# EAGLE design quadcopter (EAGLE 8.7.1)
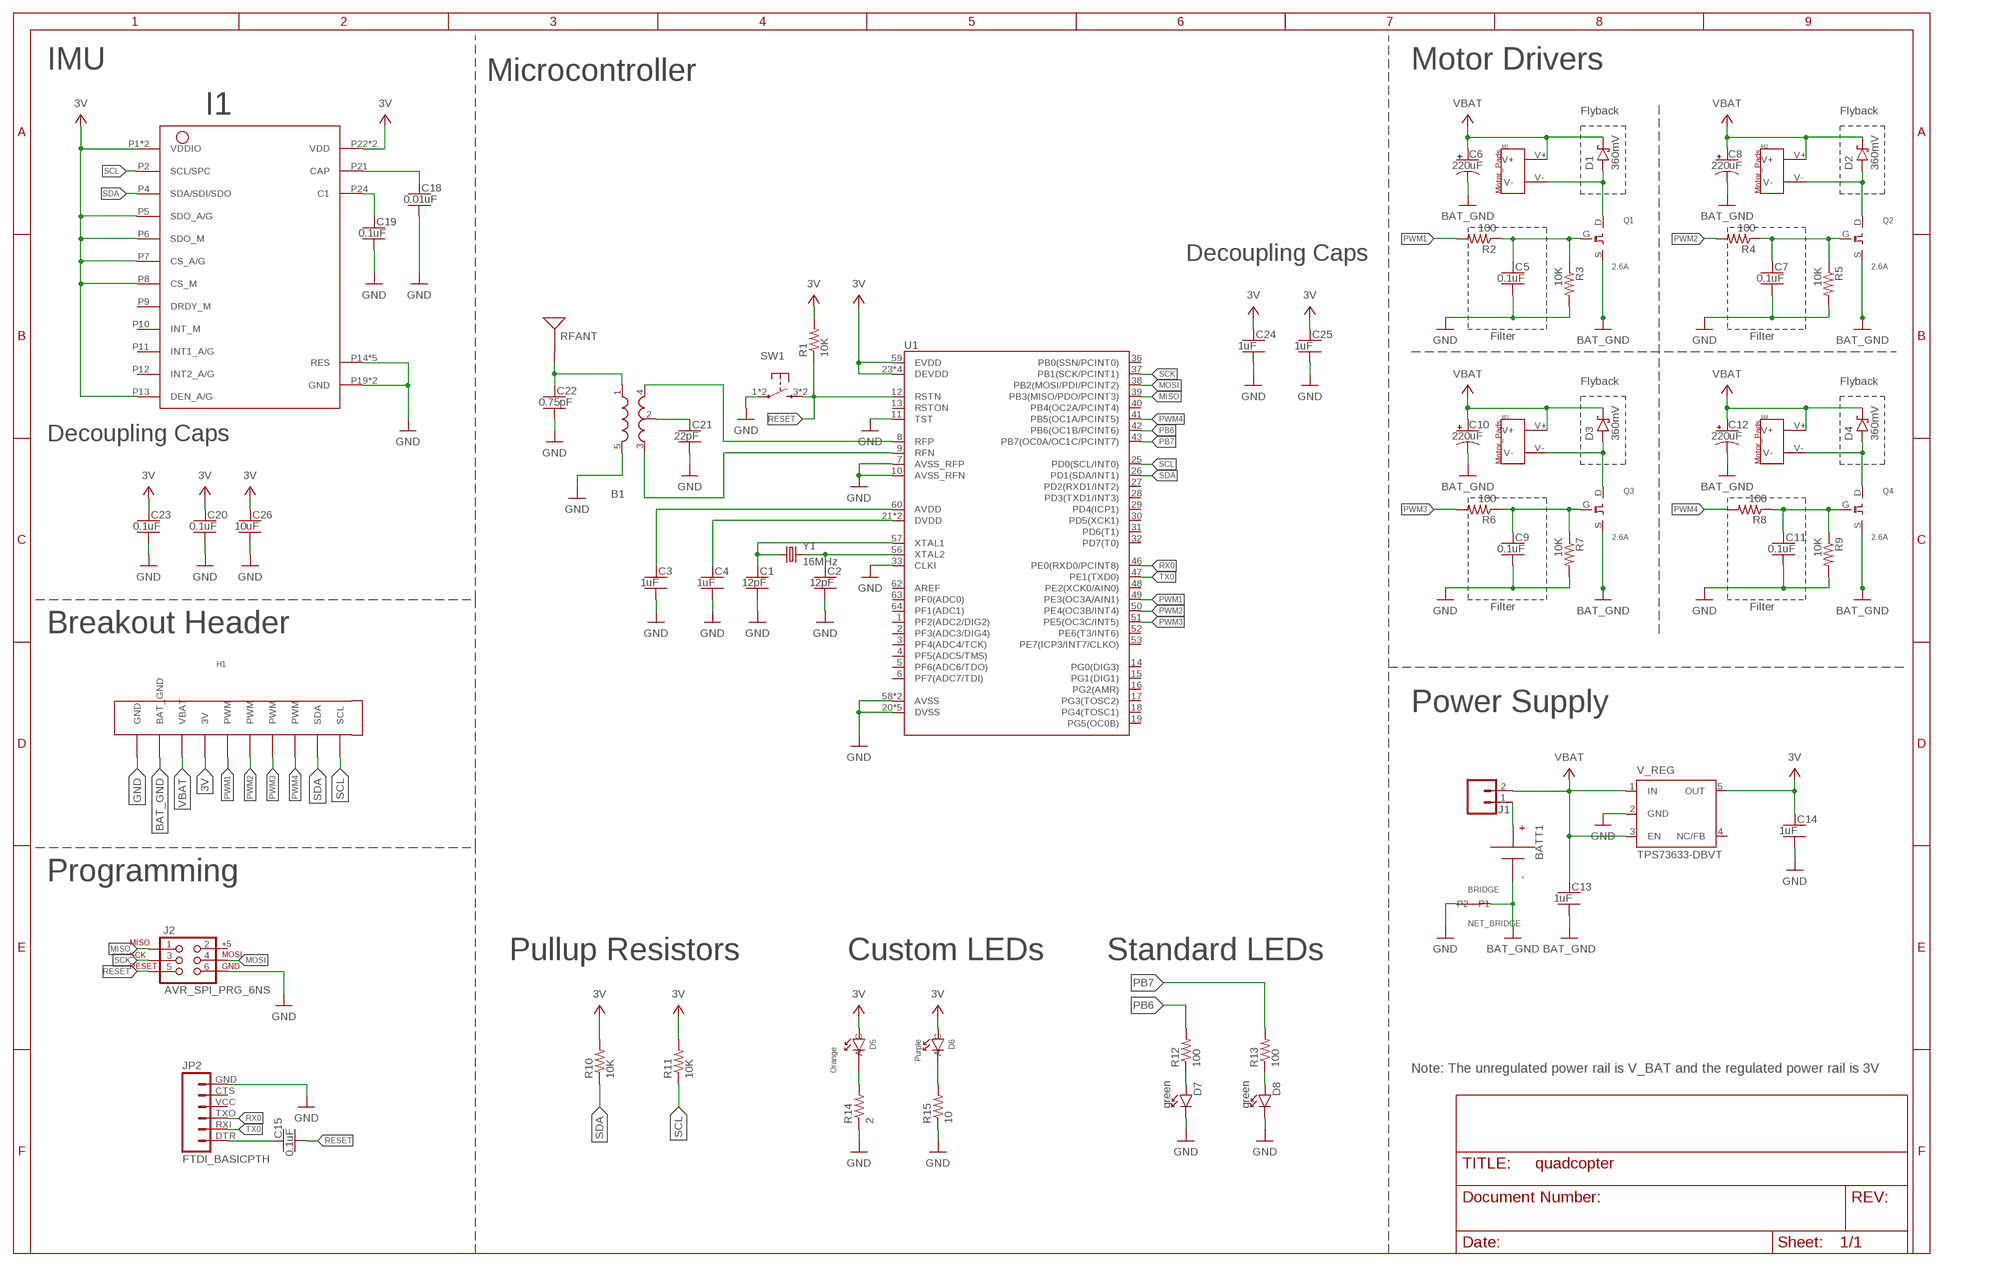
[diagram p0: schematic, sheet 1]
FRAME1 (FRAME_B_L): CREATOR: Unknown; DIST: Unknown; DISTPN: Unknown

## Parts
B1  BALUN0805  [BALUN]
BATT1  BATTERY-HUBSAN-W/HOLDER  [BATTERY-W/HOLDER-380MAH-HUBSAN]
BRIDGE  NET_BRIDGE  [NET_BRIDGE]
C1  12pF  CAPACITOR-NP_SMD-2012-0805_CERAMIC-12PF  [CAPC2012X140_HS]
C2  12pF  CAPACITOR-NP_SMD-2012-0805_CERAMIC-12PF  [CAPC2012X140_HS]
C3  1uF  CAPACITOR-NP_SMD-2012-0805_CERAMIC-1UF  [CAPC2012X140_HS]
C4  1uF  CAPACITOR-NP_SMD-2012-0805_CERAMIC-1UF  [CAPC2012X140_HS]
C5  0.1uF  CAPACITOR-NP_SMD-2012-0805_CERAMIC-0.1UF  [CAPC2012X140_HS]
C6  220uF  CAPACITOR-POL_SMD-7043-D_TANTALUM-220UF  [CAPMP7343X310_HS]
C7  0.1uF  CAPACITOR-NP_SMD-2012-0805_CERAMIC-0.1UF  [CAPC2012X140_HS]
C8  220uF  CAPACITOR-POL_SMD-7043-D_TANTALUM-220UF  [CAPMP7343X310_HS]
C9  0.1uF  CAPACITOR-NP_SMD-2012-0805_CERAMIC-0.1UF  [CAPC2012X140_HS]
C10  220uF  CAPACITOR-POL_SMD-7043-D_TANTALUM-220UF  [CAPMP7343X310_HS]
C11  0.1uF  CAPACITOR-NP_SMD-2012-0805_CERAMIC-0.1UF  [CAPC2012X140_HS]
C12  220uF  CAPACITOR-POL_SMD-7043-D_TANTALUM-220UF  [CAPMP7343X310_HS]
C13  1uF  CAPACITOR-NP_SMD-2012-0805_CERAMIC-1UF  [CAPC2012X140_HS]
C14  1uF  CAPACITOR-NP_SMD-2012-0805_CERAMIC-1UF  [CAPC2012X140_HS]
C15  0.1uF  CAPACITOR-NP_SMD-2012-0805_CERAMIC-0.1UF  [CAPC2012X140_HS]
C18  0.01uF  CAPACITOR-NP_SMD-2012-0805_CERAMIC-0.01UF  [CAPC2012X140_HS]
C19  0.1uF  CAPACITOR-NP_SMD-2012-0805_CERAMIC-0.1UF  [CAPC2012X140_HS]
C20  0.1uF  CAPACITOR-NP_SMD-2012-0805_CERAMIC-0.1UF  [CAPC2012X140_HS]
C21  22pF  CAPACITOR-NP_SMD-2012-0805_CERAMIC-22PF  [CAPC2012X140_HS]
C22  0.75pF  CAPACITOR-NP_SMD-2012-0805_CERAMIC-0.75PF  [CAPC2012X140_HS]
C23  0.1uF  CAPACITOR-NP_SMD-2012-0805_CERAMIC-0.1UF  [CAPC2012X140_HS]
C24  1uF  CAPACITOR-NP_SMD-2012-0805_CERAMIC-1UF  [CAPC2012X140_HS]
C25  1uF  CAPACITOR-NP_SMD-2012-0805_CERAMIC-1UF  [CAPC2012X140_HS]
C26  10uF  CAPACITOR-NP_SMD-2012-0805_CERAMIC-10UF  [CAPC2012X140_HS]
D1  360mV  DIODE-SCHOTTKY_SMD-SOD123-360MV  [SOD3716X135_HS]
D2  360mV  DIODE-SCHOTTKY_SMD-SOD123-360MV  [SOD3716X135_HS]
D3  360mV  DIODE-SCHOTTKY_SMD-SOD123-360MV  [SOD3716X135_HS]
D4  360mV  DIODE-SCHOTTKY_SMD-SOD123-360MV  [SOD3716X135_HS]
D5  Orange  LED_ORANGE  [LED_ORANGE]
D6  Purple  LED_PURPLE  [LED_PURPLE]
D7  green  DIODE-LED_SMD-2012-0805-GREEN  [LEDSC125X200X120-2_HS]
D8  green  DIODE-LED_SMD-2012-0805-GREEN  [LEDSC125X200X120-2_HS]
H1  BREAKOUT_HEADER  [BREAKOUT_HEADER]
I1  IMU_LSM9DS1TR  [IMU_LSM9DS1TR]
J1  MALE_HEADER_2POS-2X1-0.1IN  [MALE_HEADER_2X1_0.1IN]
J2  AVR_SPI_PRG_6NS  [2X3-NS]
JP2  FTDI_BASICPTH  [FTDI_BASIC]
M1  MOTOR_PADS  [MOTOR_PADS]
M2  MOTOR_PADS  [MOTOR_PADS]
M3  MOTOR_PADS  [MOTOR_PADS]
M4  MOTOR_PADS  [MOTOR_PADS]
Q1  2.6A  N_CHANNEL_FET  [MOSFET_N-CHANNEL]
Q2  2.6A  N_CHANNEL_FET  [MOSFET_N-CHANNEL]
Q3  2.6A  N_CHANNEL_FET  [MOSFET_N-CHANNEL]
Q4  2.6A  N_CHANNEL_FET  [MOSFET_N-CHANNEL]
R1  10K  RESISTOR_SMD-2012-0805-10K  [RESC2012X60_HS]
R2  100  RESISTOR_SMD-2012-0805-100  [RESC2012X60_HS]
R3  10K  RESISTOR_SMD-2012-0805-10K  [RESC2012X60_HS]
R4  100  RESISTOR_SMD-2012-0805-100  [RESC2012X60_HS]
R5  10K  RESISTOR_SMD-2012-0805-10K  [RESC2012X60_HS]
R6  100  RESISTOR_SMD-2012-0805-100  [RESC2012X60_HS]
R7  10K  RESISTOR_SMD-2012-0805-10K  [RESC2012X60_HS]
R8  100  RESISTOR_SMD-2012-0805-100  [RESC2012X60_HS]
R9  10K  RESISTOR_SMD-2012-0805-10K  [RESC2012X60_HS]
R10  10K  RESISTOR_SMD-2012-0805-10K  [RESC2012X60_HS]
R11  10K  RESISTOR_SMD-2012-0805-10K  [RESC2012X60_HS]
R12  100  RESISTOR_SMD-2012-0805-100  [RESC2012X60_HS]
R13  100  RESISTOR_SMD-2012-0805-100  [RESC2012X60_HS]
R14  2  0805_RES2_OHM  [RESISTOR_0805]
R15  10  0805_RES10_OHM  [RESISTOR_0805]
RFANT  ANTENNA2SMD5  [ANTENNA-CHIP5]
SW1  PUSHBUTTON_SMD-VERTICAL-1  [TE_FSM8JSMA_HS]
U1  ATMEGA128RFA1  [QFN-64]
V_REG  TPS73633-DBVT  [SOT23-DBV]
Y1  16MHz  CRYSTAL5X3  [CRYSTAL-SMD-5X3]

## Nets
3V: C14.1 C20.1 C23.1 C24.1 C25.1 C26.1 D5.A D6.A H1.1(3V) I1.P1(VDDIO) I1.P3(VDDIO) I1.P5(SDO_A/G) I1.P6(SDO_M) I1.P7(CS_A/G) I1.P8(CS_M) I1.P13(DEN_A/G) I1.P22(VDD) I1.P23(VDD) R1.2 R10.2 R11.2 U1.23(DEVDD) U1.34(DEVDD) U1.44(DEVDD) U1.54(DEVDD) U1.59(EVDD) V_REG.5(OUT)
BAT_GND [HIGHCURRENT]: BATT1.-(N) BRIDGE.P2 C6.2(-) C8.2(-) C10.2(-) C12.2(-) C13.2 H1.2(BAT_GND) Q1.S Q2.S Q3.S Q4.S
GND: B1.5(GND) BRIDGE.P1 C1.2 C2.2 C3.2 C4.2 C5.2 C7.2 C9.2 C11.2 C14.2 C18.2 C19.2 C20.2 C21.2 C22.2 C23.2 C24.2 C25.2 C26.2 D7.C D8.C H1.3(GND) I1.P14(RES) I1.P15(RES) I1.P16(RES) I1.P17(RES) I1.P18(RES) I1.P19(GND) I1.P20(GND) J2.6 JP2.GND R3.2 R5.2 R7.2 R9.2 R14.IN R15.IN SW1.1 SW1.2 U1.7(AVSS_RFP) U1.10(AVSS_RFN) U1.11(TST) U1.20(DVSS) U1.24(DVSS) U1.33(CLKI) U1.35(DVSS) U1.45(DVSS) U1.55(DVSS) U1.58(AVSS) U1.61(AVSS) V_REG.2(GND)
MISO: J2.1 U1.39(PB3(MISO/PDO/PCINT3))
MOSI: J2.4 U1.38(PB2(MOSI/PDI/PCINT2))
N$1: D6.C R15.OUT
N$2: B1.4(OUT1) U1.8(RFP)
N$3: B1.3(OUT2) U1.9(RFN)
N$4: C4.1 U1.21(DVDD) U1.22(DVDD)
N$5: C2.1 U1.56(XTAL2) Y1.3
N$6: C3.1 U1.60(AVDD)
N$7: C1.1 U1.57(XTAL1) Y1.1
N$8 [HIGHCURRENT]: D1.A M1.V- Q1.D
N$9: D5.C R14.OUT
N$10: C7.1 Q2.G R4.1 R5.1
N$11 [HIGHCURRENT]: D2.A M2.V- Q2.D
N$12: C9.1 Q3.G R6.1 R7.1
N$13: C5.1 Q1.G R2.1 R3.1
N$14 [HIGHCURRENT]: D3.A M3.V- Q3.D
N$15: C11.1 Q4.G R8.1 R9.1
N$17: D7.A R12.1
N$18 [HIGHCURRENT]: BATT1.+(P) J1.1
N$19: B1.2(GND) C21.1
N$20 [HIGHCURRENT]: D4.A M4.V- Q4.D
N$21: C18.1 I1.P21(CAP)
N$23: C19.1 I1.P24(C1)
N$24 [RFSIG]: B1.1(IN) C22.1 RFANT.FEED(SIGNAL)
N$25: C15.1 JP2.DTR
N$26: D8.A R13.1
PB6: R12.2 U1.42(PB6(OC1B/PCINT6))
PB7: R13.2 U1.43(PB7(OC0A/OC1C/PCINT7))
PWM1: H1.4(PWM) R2.2 U1.49(PE3(OC3A/AIN1))
PWM2: H1.5(PWM) R4.2 U1.50(PE4(OC3B/INT4))
PWM3: H1.6(PWM) R6.2 U1.51(PE5(OC3C/INT5))
PWM4: H1.7(PWM) R8.2 U1.41(PB5(OC1A/PCINT5))
RESET: C15.2 J2.5 R1.1 SW1.3 SW1.4 U1.12(RSTN)
RX0: JP2.TXO U1.46(PE0(RXD0/PCINT8))
SCK: J2.3 U1.37(PB1(SCK/PCINT1))
SCL: H1.8(SCL) I1.P2(SCL/SPC) R11.1 U1.25(PD0(SCL/INT0))
SDA: H1.9(SDA) I1.P4(SDA/SDI/SDO) R10.1 U1.26(PD1(SDA/INT1))
TX0: JP2.RXI U1.47(PE1(TXD0))
VBAT [HIGHCURRENT]: C6.1(+) C8.1(+) C10.1(+) C12.1(+) C13.1 D1.C D2.C D3.C D4.C H1.10(VBAT) J1.2 M1.V+ M2.V+ M3.V+ M4.V+ V_REG.1(IN) V_REG.3(EN)
Unconnected: I1.P9(DRDY_M) I1.P10(INT_M) I1.P11(INT1_A/G) I1.P12(INT2_A/G) J2.2 JP2.CTS JP2.VCC U1.1(PF2(ADC2/DIG2)) U1.2(PF3(ADC3/DIG4)) U1.3(PF4(ADC4/TCK)) U1.4(PF5(ADC5/TMS)) U1.5(PF6(ADC6/TDO)) U1.6(PF7(ADC7/TDI)) U1.13(RSTON) U1.14(PG0(DIG3)) U1.15(PG1(DIG1)) U1.16(PG2(AMR)) U1.17(PG3(TOSC2)) U1.18(PG4(TOSC1)) U1.19(PG5(OC0B)) U1.27(PD2(RXD1/INT2)) U1.28(PD3(TXD1/INT3)) U1.29(PD4(ICP1)) U1.30(PD5(XCK1)) U1.31(PD6(T1)) U1.32(PD7(T0)) U1.36(PB0(SSN/PCINT0)) U1.40(PB4(OC2A/PCINT4)) U1.48(PE2(XCK0/AIN0)) U1.52(PE6(T3/INT6)) U1.53(PE7(ICP3/INT7/CLKO)) U1.62(AREF) U1.63(PF0(ADC0)) U1.64(PF1(ADC1)) V_REG.4(NC/FB)

## Notes on the sheet
- IMU | Motor Drivers
- Microcontroller
- Flyback | Flyback
- Decoupling Caps
- Filter | Filter
- Flyback | Flyback
- Decoupling Caps
- Filter | Filter
- Breakout Header
- Power Supply
- Programming
- Pullup Resistors | Custom LEDs | Standard LEDs
- Note: The unregulated power rail is V_BAT and the regulated power rail is 3V

## Library data of the parts
B1 = quadparts_prebuilt:BALUN: 0805 footprint balun- Ember 351/357; CREATOR: Swanson; DATASHEET: http://katalog.we-online.de/pbs/datasheet/748421245.pdf; DIST: Digikey; DISTPN: 732-2230-6-ND; MFR: Wurth Electronics Inc; MPN: 748421245; PRICE: 2.63; REVIEWER: Swanson
BATT1 = quadparts_prebuilt:BATTERY; CREATOR: Swanson; DIST: AMAZON; DISTPN: http://www.amazon.com/dp/B00RROB6Q4?smid=AMNTPWSAB5H0S; MFR: HUBSAN; MPN: X4-H107C-8-in-1; REVIEWER: Swanson
BRIDGE = custom_Ben:NET_BRIDGE: NET BRIDGE; CREATOR: AGONZALES; DIST: NA; DISTPN: NA
C1 C2 = quadparts_prebuilt:CAPACITOR-NP_: Nonpolarized capacitor; CREATOR: Swanson; DIST: Digikey; DISTPN: 490-5531-1-ND; MFR: Murata Electronics North America; MPN: GRM21A5C2E120JW01D; REVIEWER: Swanson
C3 C4 C13 C14 C24 C25 = quadparts_prebuilt:CAPACITOR-NP_: Nonpolarized capacitor; CREATOR: Swanson; DIST: Digikey; DISTPN: 587-1281-1-ND; MFR: Taiyo Yuden; MPN: TMK212B7105KG-T; REVIEWER: Swanson
C5 C7 C9 C11 C15 C19 C20 C23 = quadparts_prebuilt:CAPACITOR-NP_: Nonpolarized capacitor; CREATOR: Swanson; DIST: Digikey; DISTPN: 445-1418-1-ND; MFR: TDK; MPN: C2012X7R2A104K125AA; REVIEWER: Swanson
C6 C8 C10 C12 = quadparts_prebuilt:CAPACITOR-POL_: Polarized capacitor; CREATOR: Swanson; DIST: Digikey; DISTPN: 478-8912-1-ND; MFR: AVX Corporation; MPN: TAJD227K006RNJ; REVIEWER: Swanson
C18 = quadparts_prebuilt:CAPACITOR-NP_: Nonpolarized capacitor; CREATOR: Swanson; DIST: Digikey; DISTPN: 1608-1458-1-ND; MFR: Knowles Syfer; MPN: 0805J0500104KJT; REVIEWER: Swanson
C21 = quadparts_prebuilt:CAPACITOR-NP_: Nonpolarized capacitor; CREATOR: Swanson; DIST: Digikey; DISTPN: 490-5534-1-ND; MFR: Murata Electronics North America; MPN: GRM21A5C2E220JW01D; REVIEWER: Swanson
C22 = quadparts_prebuilt:CAPACITOR-NP_: Nonpolarized capacitor; CREATOR: Swanson; DIST: Digikey; DISTPN: 490-3585-1-ND; MFR: Murata Electronics North America; MPN: GQM2195C2AR75CB01D; REVIEWER: Swanson
C26 = quadparts_prebuilt:CAPACITOR-NP_: Nonpolarized capacitor; CREATOR: Swanson; DIST: Digikey; DISTPN: 445-14388-1-ND; MFR: TDK Corporation; MPN: C2012X5R1E106M085AC; REVIEWER: Swanson
D1-D4 = quadparts_prebuilt:DIODE-SCHOTTKY_: Schottky diode; CREATOR: Swanson; DIST: Digikey; DISTPN: CRS08QMCT-ND; MFR: Toshiba Semiconductor and Storage; MPN: CRS08(TE85L,Q,M); REVIEWER: Swanson
D5 = LED:LED_ORANGE: Orange LED by Lumileds Forward Voltage: 2.1V Max Current: 125mA Mounting Type: Surface Mount; CREATOR: Ben Phan; DIST: Digikey; DISTPN: 1416-1492-6-ND; MFR: Lumileds; MPN: L135-O615003500001
D6 = LED:LED_PURPLE: Purple LED by Lumileds Forward Voltage: 2.8V Max current: 300mA Mounting Type: Surface Mount; CREATOR: Ben Phan; DIST: Digikey; DISTPN: 1416-1961-1-ND; MFR: Lumileds; MPN: L1SP-PRP2003500000
D7 D8 = quadparts_prebuilt:DIODE-LED_: Light emitting diode; CREATOR: Swanson; DIST: Digikey; DISTPN: 160-1179-1-ND; MFR: Lite-On Inc; MPN: LTST-C170GKT; REVIEWER: Swanson
H1 = custom_Ben:BREAKOUT_HEADER: Breakout Header; CREATOR: Ben Phan; DIST: NA; DISTPN: NA
I1 = custom:IMU_LSM9DS1TR; CREATOR: AGONZALES; DIST: DIGIKEY; DISTPN: 497-14946-1-ND; MFR: STMicroelectronics
J1 = custom_Ben:MALE_HEADER_2POS: 2 pin single inline pin header, socket, or connector; CREATOR: SWANSON; DIST: Digikey; DISTPN: 3M9447-ND; MFR: 3M; MPN: 961102-6404-AR; REVIEWER: Swanson
J2 = quadparts_prebuilt:AVR_SPI_PRG_6: AVR ISP 6 Pin This is the reduced ISP connector for AVR programming. Common on Arduino. This footprint will take up less PCB space and can be used with a 10-pin to 6-pin adapter such as SKU: BOB-08508; CREATOR: Swanson; DATASHEET: http://portal.fciconnect.com/Comergent//fci/drawing/67996.pdf; DIST: Digikey; DISTPN: 609-3234-ND; MFR: Amphenol FCI; MPN: 67997-206HLF; PRICE: 0.31; REVIEWER: Swanson
JP2 = quadparts_prebuilt:FTDI_BASIC: FTDI Basic header with labels; CREATOR: Swanson; DATASHEET: http://portal.fciconnect.com/Comergent//fci/drawing/68015.pdf; DIST: Digikey; DISTPN: 609-3327-ND; MFR: Amphenol FCI; MPN: 68016-406HLF; PRICE: 0.33; REVIEWER: Swanson
M1-M4 = quadparts_prebuilt:MOTOR_PADS; CREATOR: Swanson; DIST: NA; DISTPN: NA; MFR: NA; MPN: NA; REVIEWER: Swanson
Q1-Q4 = custom_Ben:N_CHANNEL_FET: N-Channel MOSFET; CREATOR: Ben Phan; DIST: Digikey; DISTPN: SI2302CDS-T1-E3CT-ND; MFR: Vishay Siliconix; MPN: SI2302CDS-T1-E3
R1 R3 R5 R7 R9-R11 = quadparts_prebuilt:RESISTOR_: Resistor; CREATOR: Swanson; DIST: Digikey; DISTPN: 311-10KARCT-ND; MFR: Yageo; MPN: RC0805JR-0710KL; REVIEWER: Swanson
R2 R4 R6 R8 R12 R13 = quadparts_prebuilt:RESISTOR_: Resistor; CREATOR: Swanson; DIST: Digikey; DISTPN: 311-100ARCT-ND; MFR: Yageo; MPN: RC0805JR-07100RL; REVIEWER: Swanson
R14 = custom_Ben:0805_RES: 0805 Resistors; CREATOR: AGONZALES; DIST: DIGIKEY; DISTPN: 311-2.0ARCT-ND
R15 = custom_Ben:0805_RES: 0805 Resistors; CREATOR: AGONZALES; DIST: DIGIKEY; DISTPN: 311-10.0CRCT-ND
RFANT = quadparts_prebuilt:ANTENNA2: Chip antenna Single endded antenna. Common with smaller chip antennas. CHIP4 package is the GPS Chip Antenna SKU: GPS-08418. CHIP5 package is 2.4GHz chip antenna SKU: WRL-00144.; CREATOR: Swanson; DATASHEET: http://www.linxtechnologies.com/resources/data-guides/ant-xxx-chp-x.pdf; DIST: Digikey; DISTPN: ANT-2.45-CHPCT-ND; MFR: Linx Technologies Inc.; MPN: ANT-2.45-CHP-T; PRICE: 3.16; REVIEWER: Swanson
SW1 = quadparts_prebuilt:PUSHBUTTON_: Pushbutton with 2 pins shorting 1 to 2 and two extra mounting pins 3 & 4; CREATOR: Swanson; DIST: Digikey; DISTPN: 450-1129-ND; MFR: TE Connectivity Alcoswitch Switches; MPN: FSM4JSMA; REVIEWER: Swanson
U1 = quadparts_prebuilt:ATMEGA128RFA1: ATmega128RFA1 8-bit AVR Microcontroller with Low Power 2.4GHz Transceiver for ZigBee and IEEE 802.15.4; CREATOR: Swanson; DATASHEET: http://www.atmel.com/Images/Atmel-8266-MCU_Wireless-ATmega128RFA1_Datasheet.pdf; DIST: Digikey; DISTPN: ATMEGA128RFA1-ZU-ND; MFR: Atmel; MPN: ATMEGA128RFA1-ZUR00; PRICE: 10.21; REVIEWER: Swanson
V_REG = quadparts_prebuilt:TPS73633-DBVT; CREATOR: Swanson; DATASHEET: http://www.ti.com/lit/ds/symlink/lp3985.pdf; DIST: Digikey; DISTPN: LP3985IM5X-3.0/NOPBCT-ND; MFR: Texas Instruments; MPN: LP3985IM5X-3.0/NOPB; PRICE: 0.59; REVIEWER: Swanson
Y1 = quadparts_prebuilt:CRYSTAL: Various standard crystals. Proven footprints.; CREATOR: Swanson; DATASHEET: http://www.abracon.com/Resonators/abm3b.pdf; DIST: Digikey; DISTPN: 535-9122-1-ND; MFR: Abracon LLC; MPN: ABM3B-16.000MHZ-B2-T; PRICE: 0.68; PROD_ID: XTAL-08218; REVIEWER: Swanson

## Net classes
1 RFSIG: width 0.762 mm
2 HIGHCURRENT: width 0.762 mm

## Board
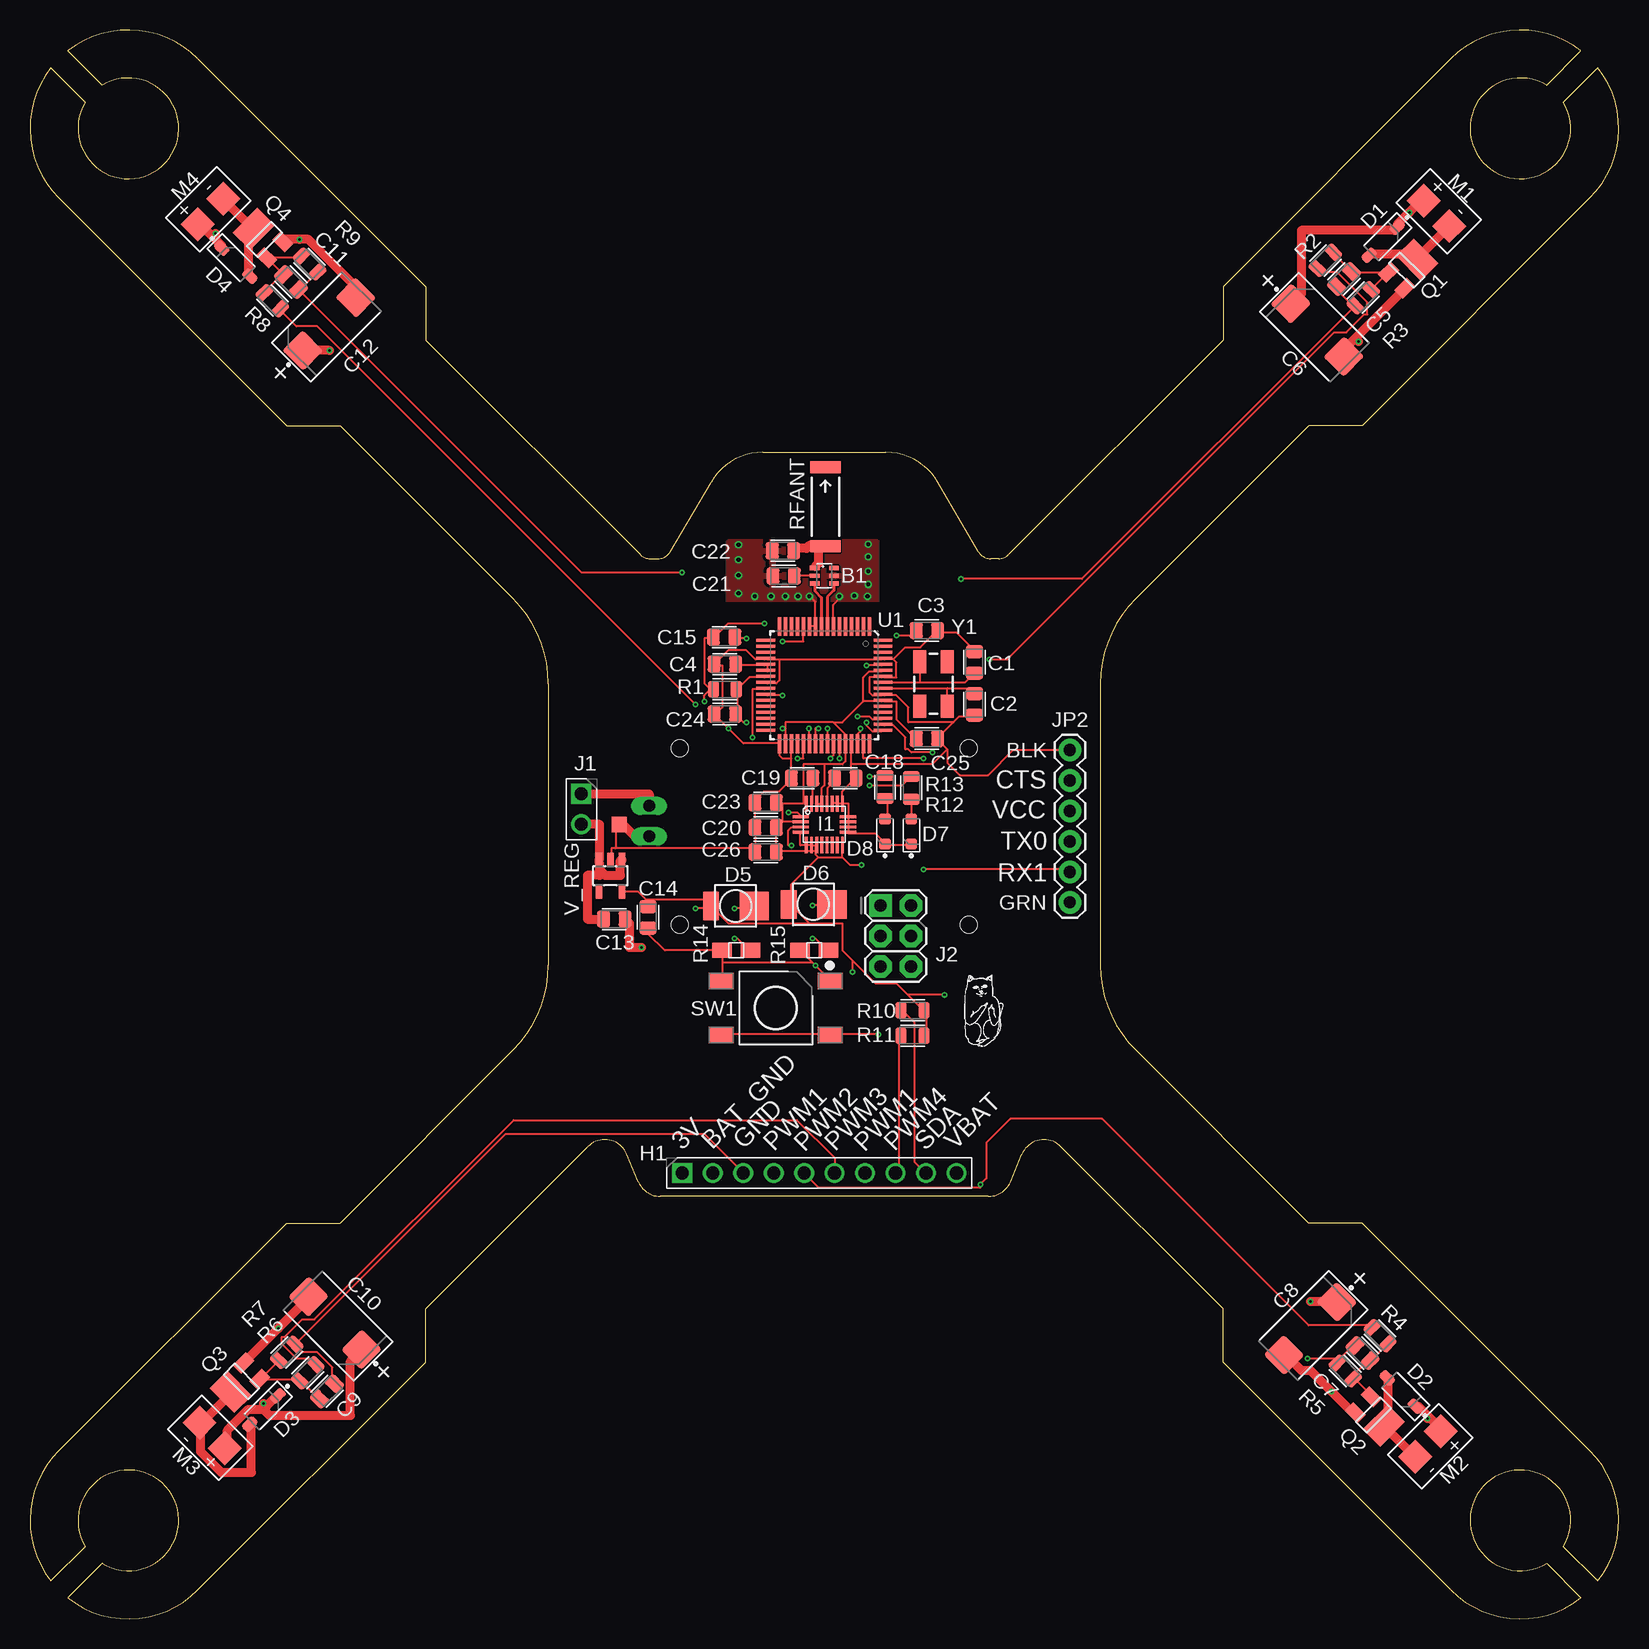
[diagram p1: board, top side]
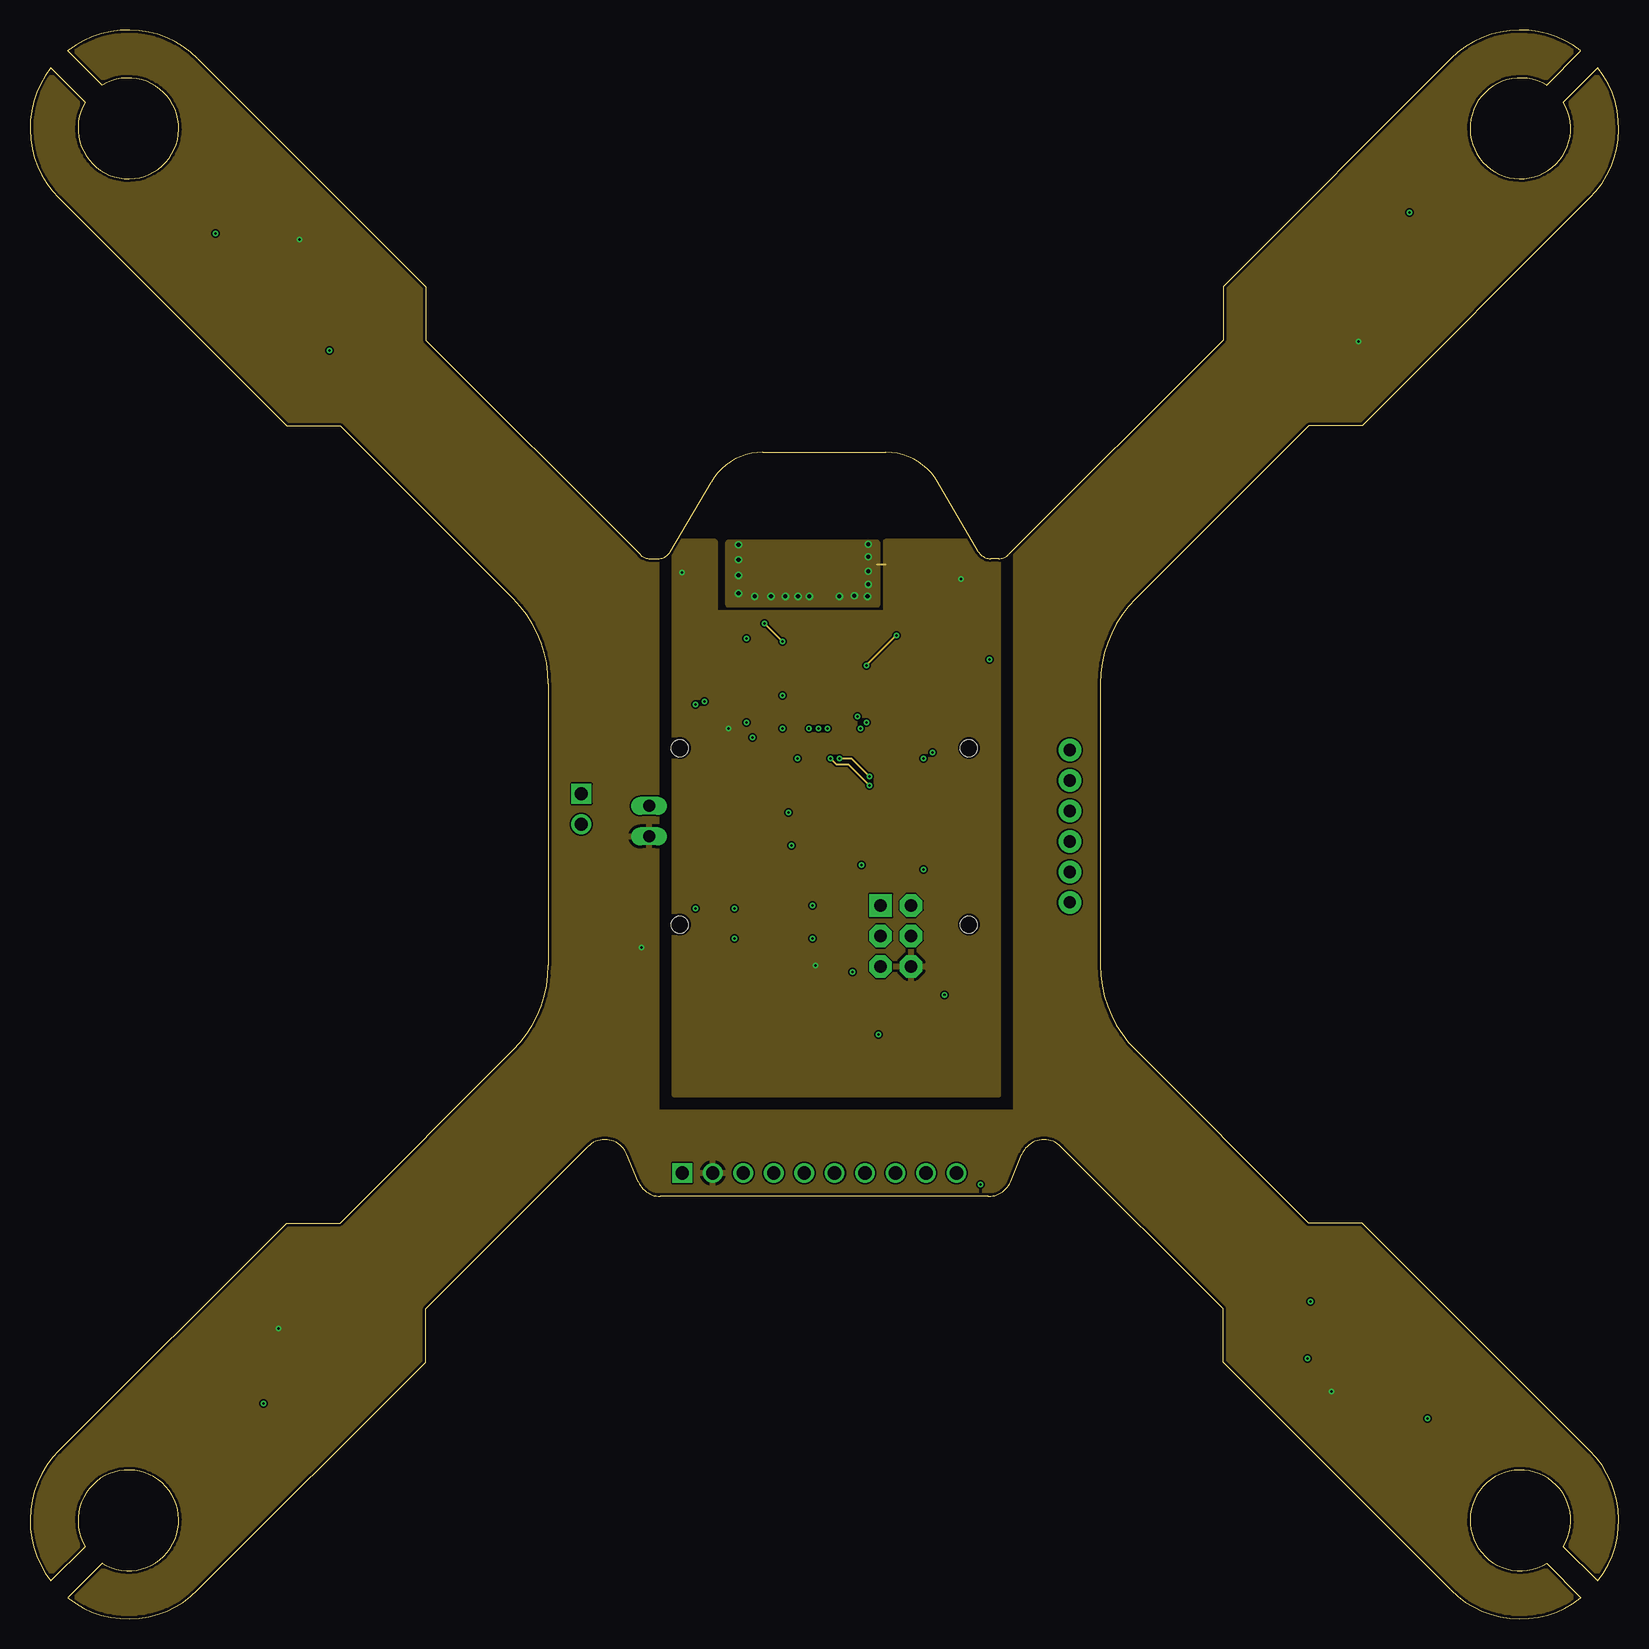
[diagram p2: board, inner layer Route2]
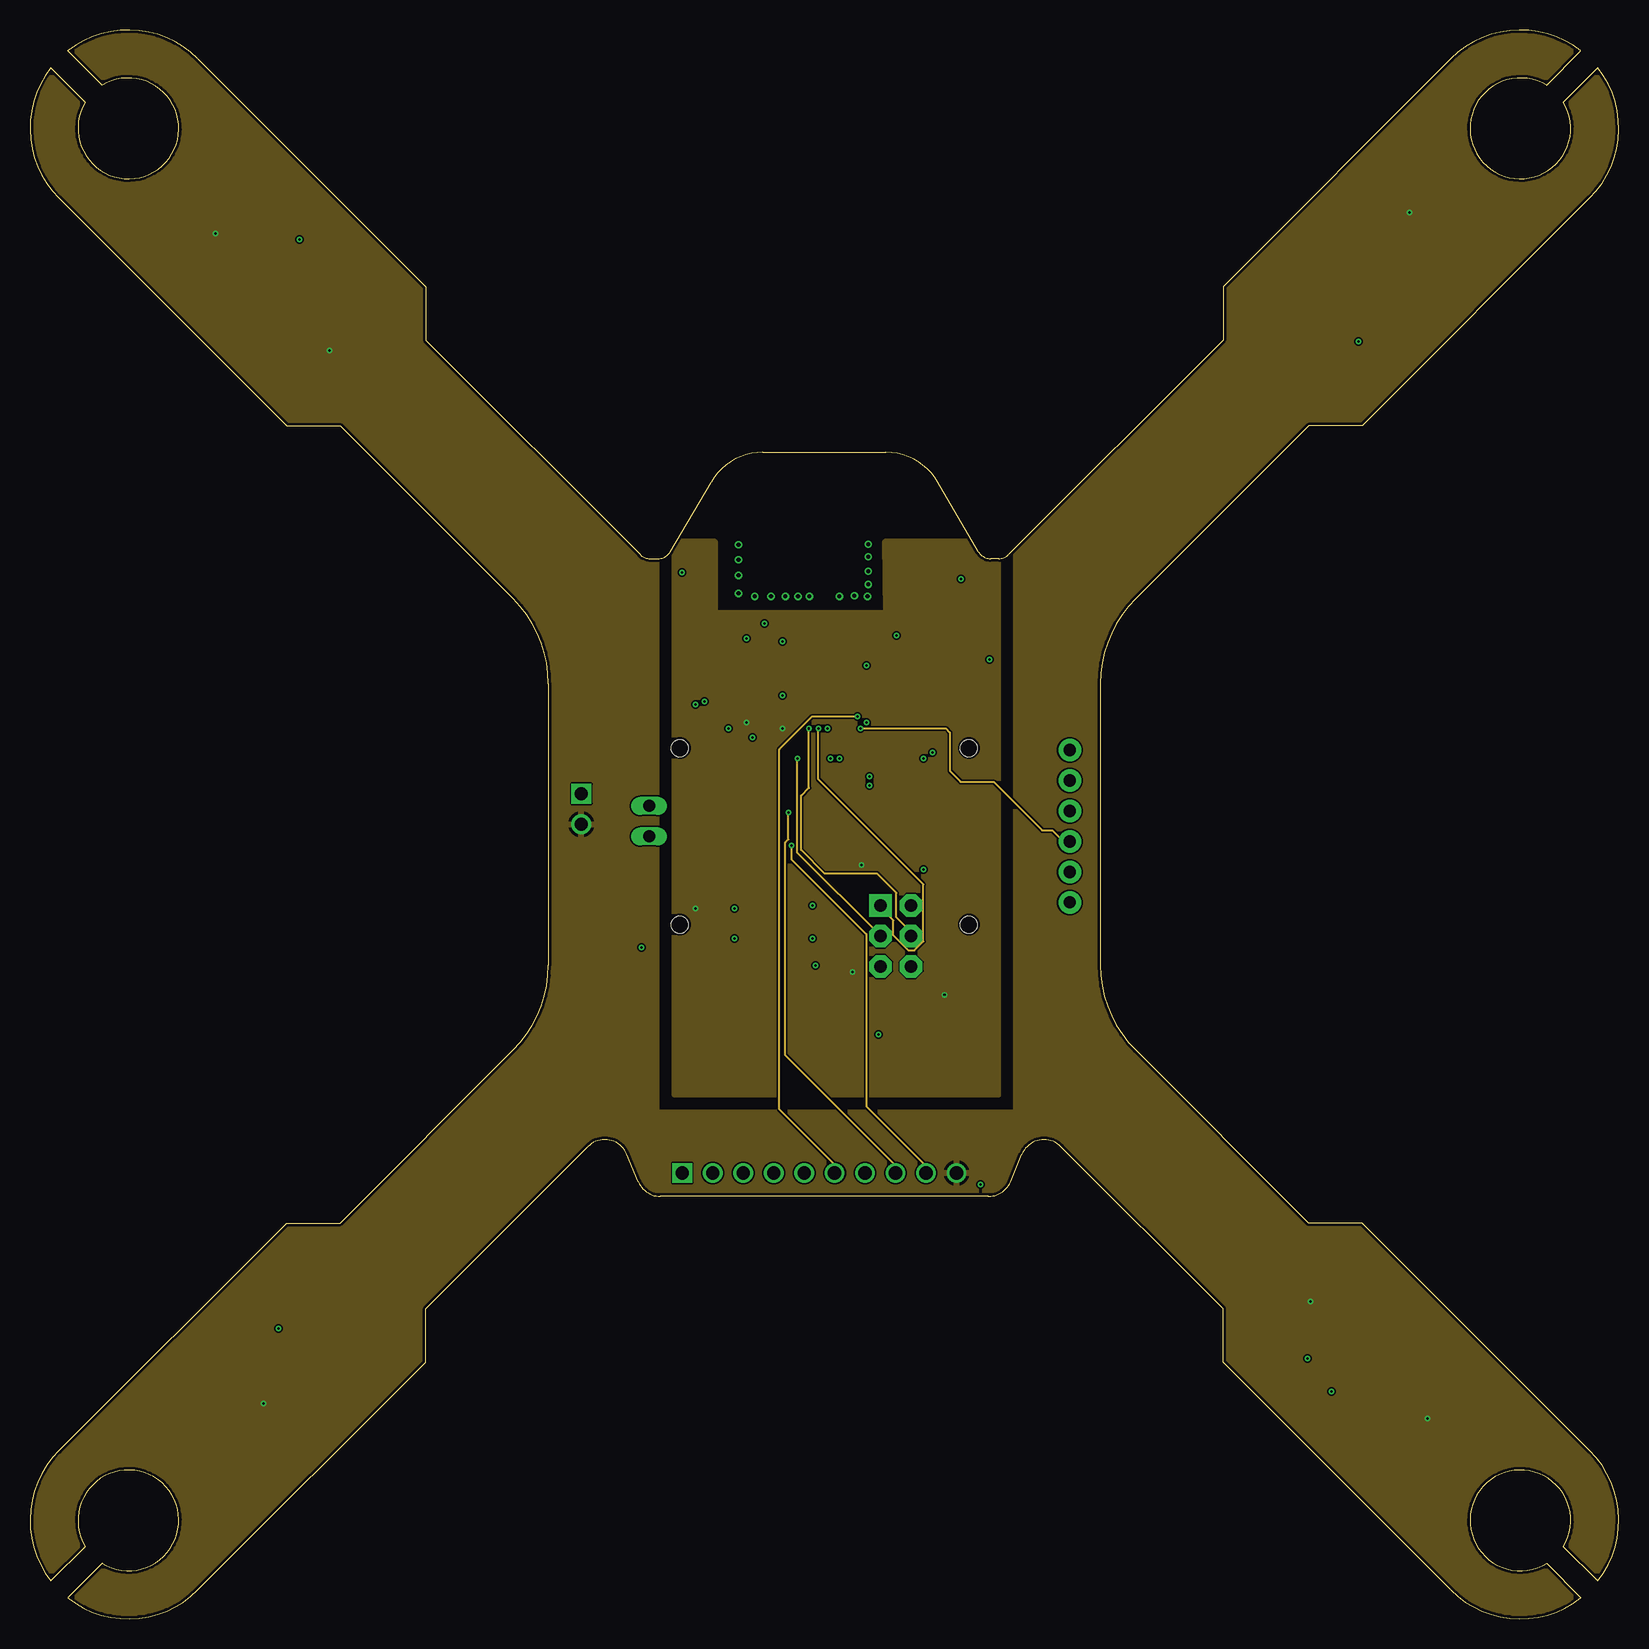
[diagram p3: board, inner layer Route15]
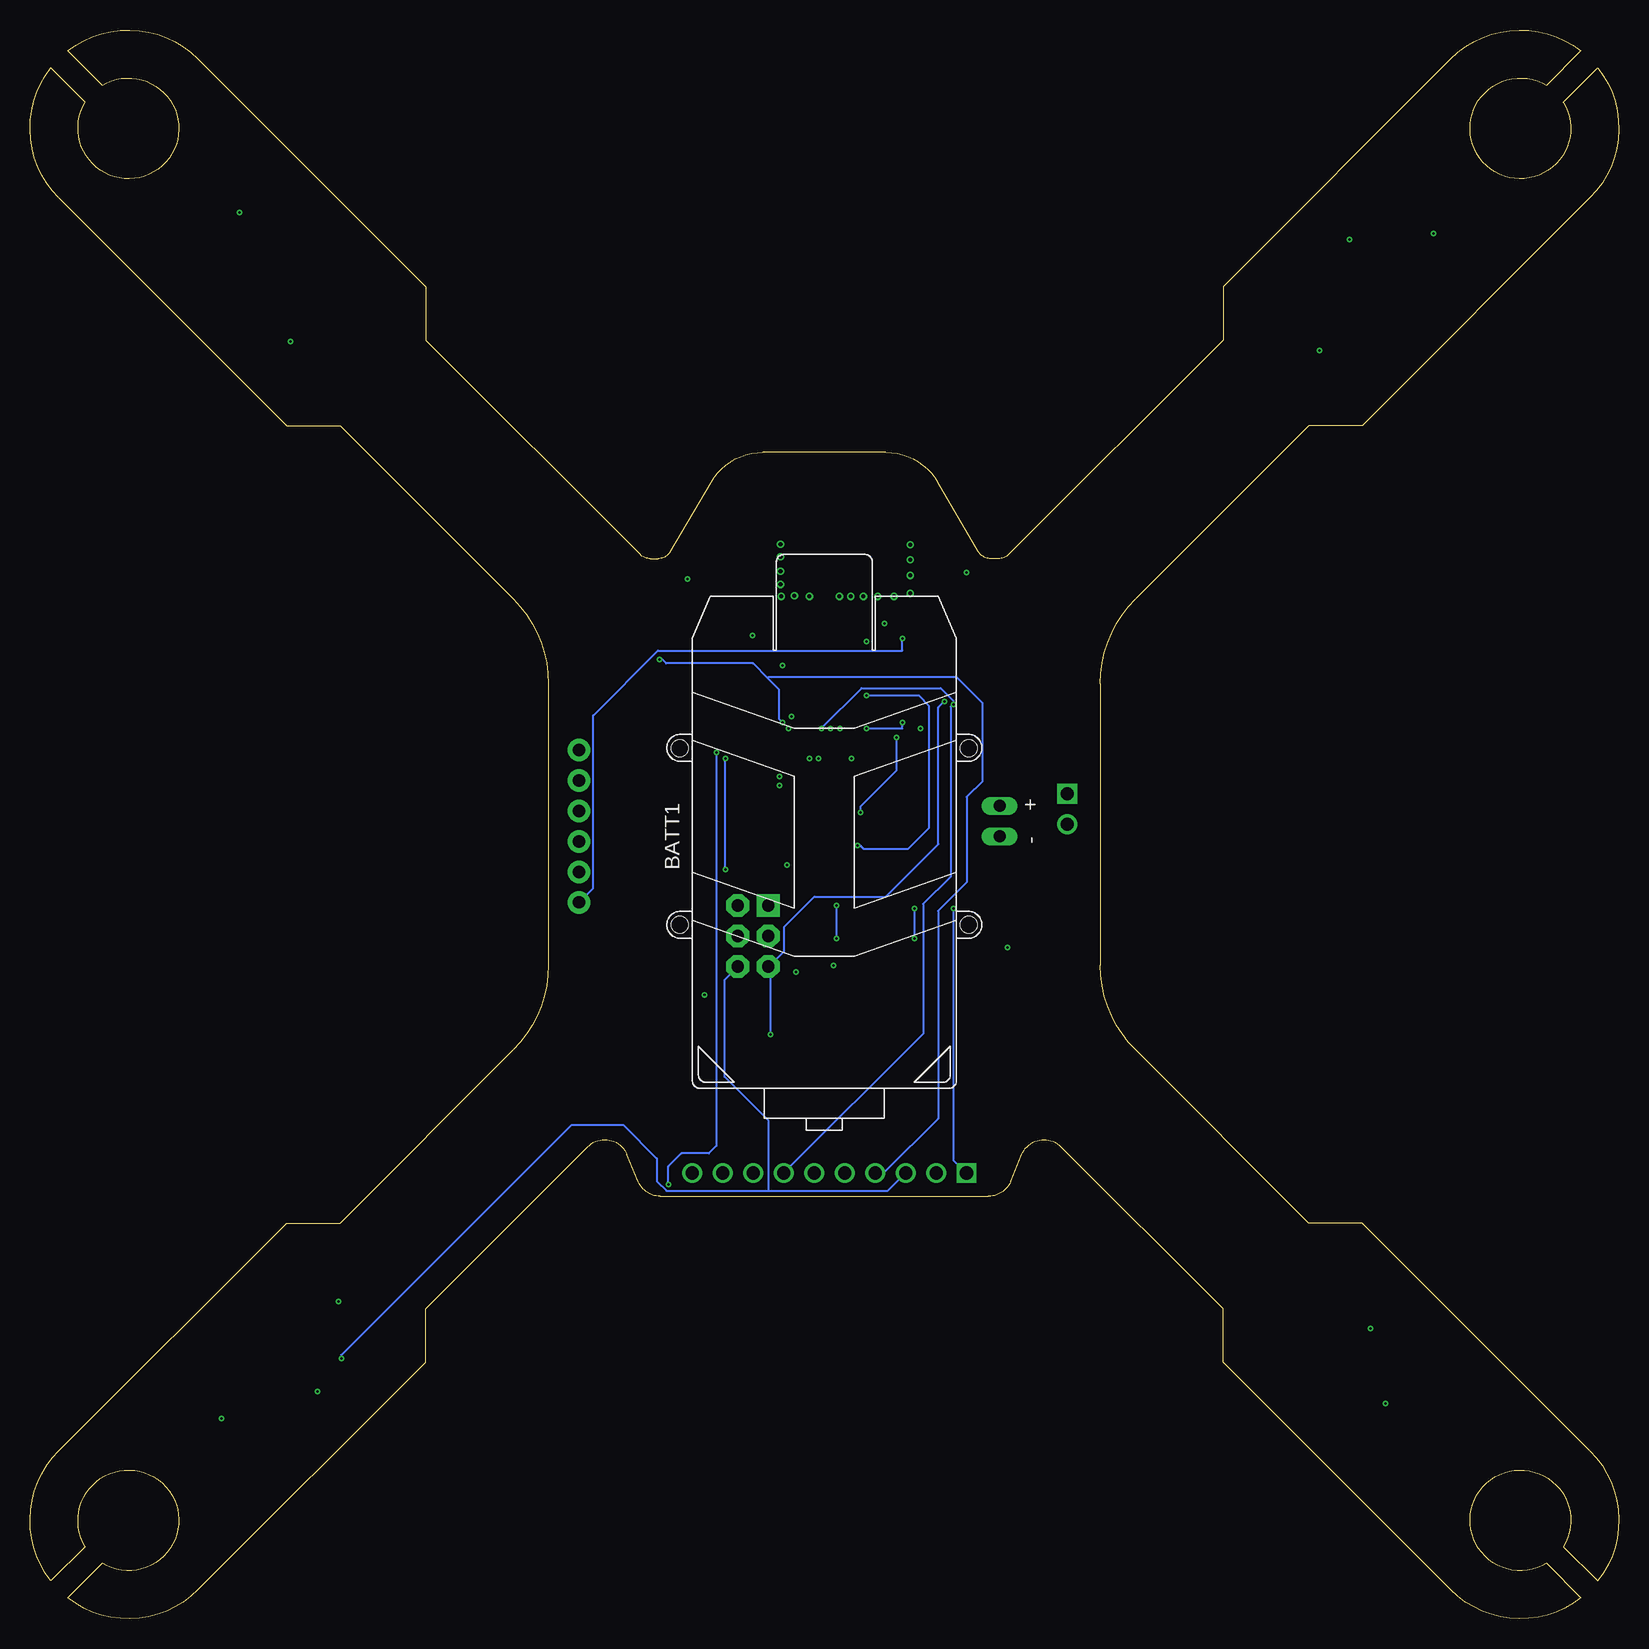
[diagram p4: board, bottom side, seen from below]

Size 132.4 x 132.4 mm. Coordinates in mm from the lower left corner, seen from the top.
Outline: 14,130 arc83 3.15,130.66 6.02,127.79 arc-332 4.61,126.38 1.74,129.25 arc83 2.4,118.4 21.38,99.42 25.84,99.42 40.27,84.99 arc-45 43.2,77.92 43.2,54.48 arc-45 40.27,47.41 25.84,32.98 21.38,32.98 2.4,14 arc83 1.74,3.15 4.61,6.02 arc-332 6.02,4.61 3.15,1.74 arc83 14,2.4 32.98,21.38 32.98,25.84 46.49,39.35 arc-112 49.75,38.7 50.69,36.43 arc67 52.53,35.2 79.86,35.2 arc67 81.71,36.43 82.65,38.7 arc-112 85.91,39.35 99.42,25.84 99.42,21.38 118.4,2.4 arc83 129.25,1.74 126.38,4.61 arc-332 127.79,6.02 130.66,3.15 arc83 130,14 111.01,32.98 106.55,32.98 92.13,47.41 arc-45 89.2,54.48 89.2,77.92 arc-45 92.13,84.99 106.55,99.42 111.01,99.42 130,118.4 arc83 130.66,129.25 127.79,126.38 arc-332 126.38,127.79 129.25,130.66 arc83 118.4,130 99.42,111.01 99.42,106.55 81.56,88.7 arc-45 80.72,88.35 80.06,88.35 arc-60 79.03,88.94 75.65,94.72 arc60 71.33,97.2 61.07,97.2 arc60 56.75,94.72 53.37,88.94 arc-60 52.34,88.35 51.68,88.35 arc-45 50.84,88.7 32.98,106.55 32.98,111.01 14,130
Copper layers (1*2*15*16): Top 0.035559375mm / dielectric 1.501140625mm / Route2 0.035559375mm / dielectric 0.149859375mm / Route15 0.035559375mm / dielectric 0.200659375mm / Bottom 0.035559375mm
Design rules "jlcpcb-4layer": minimum track width 5mil, minimum drill 0.2mm, track to track 5mil, track to pad 5mil, pad to pad 5mil, via to via 5mil, smd to smd 5mil, copper to edge 0.2mm, drill to drill 10mil, minimum pad ring 3mil, minimum via ring 5mil, stop-mask expansion 3mil, vias tented up to drill 0.2mm, thermal gap 10mil
tRestrict: area 64.4,64.7 to 67.9,67.7; area 58.2,84.4 to 70.5,84.4; 8 lines
bRestrict: area 64.4,64.7 to 67.9,67.7; area 58.1,84.4 to 70.5,84.4; 8 lines

### Footprints (pad centres in the part's own frame; a part is rotated, then mirrored left to right if it is on the bottom)
BALUN = smd 0.35 x 0.8: 1 -0.65,-0.8; 2 0,-0.8; 3 0.65,-0.8; 4 0.65,0.8; 5 0,0.8; 6 -0.65,0.8
BATTERY-W/HOLDER-380MAH-HUBSAN = drill 1 long: + -2.54,14.605; - 0,14.605 | hole 1.4: -7.35,-12.05; -7.35,12.05; 7.35,-12.05; 7.35,12.05
NET_BRIDGE = smd 0.635 x 1.27: P1 -0.3,0; P2 0.3,0
CAPC2012X140_HS = smd 1.08 x 1.42: 1 -0.895,0; 2 0.895,0
CAPMP7343X310_HS = smd 2.37 x 2.43: 1 -3.12,0; 2 3.12,0
SOD3716X135_HS = smd 1.25 x 0.8: A 1.665,0; C -1.665,0
LED_ORANGE = smd 1.32 x 2.4: A -2.05,0 | smd 2.43 x 2.4: C 1.55,0
LED_PURPLE = smd 1.32 x 2.4: A -2.06,-0.22 | smd 2.43 x 2.4: C 1.54,-0.22
LEDSC125X200X120-2_HS = smd 0.94 x 0.99: A -0.345,-0.9; C 1.745,-0.9
BREAKOUT_HEADER = drill 1.1 pad 1.65 square: 1 0,0 | drill 1.1 pad 1.65: 2 2.54,0; 3 5.08,0; 4 7.62,0; 5 10.16,0; 6 12.7,0; 7 15.24,0; 8 17.78,0; 9 20.32,0; 10 22.86,0
IMU_LSM9DS1TR = smd 0.23 x 1.35: P1 -1.505,1.725; P6 -1.505,-1.725; P7 -1.075,-1.725; P8 -0.645,-1.725; P9 -0.215,-1.725; P10 0.215,-1.725; P11 0.645,-1.725; P12 1.075,-1.725; P13 1.505,-1.725; P18 1.505,1.725; P19 1.075,1.725; P20 0.645,1.725; P21 0.215,1.725; P22 -0.215,1.725; P23 -0.645,1.725; P24 -1.075,1.725 | smd 1.35 x 0.23: P2 -1.975,0.645; P3 -1.975,0.215; P4 -1.975,-0.215; P5 -1.975,-0.645; P14 1.975,-0.645; P15 1.975,-0.215; P16 1.975,0.215; P17 1.975,0.645
MALE_HEADER_2X1_0.1IN = drill 1.1 pad 1.65 square: 1 0,0 | drill 1.1 pad 1.65: 2 2.54,0
2X3-NS = drill 1.016 pad 1.88 square: 1 -2.54,-1.27 | drill 1.016 pad 1.88 octagon: 2 -2.54,1.27; 3 0,-1.27; 4 0,1.27; 5 2.54,-1.27; 6 2.54,1.27
FTDI_BASIC = drill 1.016 pad 1.88: CTS 10.16,0; DTR 0,0; GND 12.7,0; RXI 2.54,0; TXO 5.08,0; VCC 7.62,0
MOTOR_PADS = smd 2 x 2: V+ -1,0; V- 2,0
MOSFET_N-CHANNEL = smd 2.9 x 2.05: D 0,1.25 | smd 1 x 1.5: G -0.95,-1.2; S 0.95,-1.2
RESC2012X60_HS = smd 0.92 x 1.38: 1 -0.955,0; 2 0.955,0
RESISTOR_0805 = smd 1.635 x 1.25: IN -1.183,0; OUT 1.183,0
ANTENNA-CHIP5 = smd 1.016 x 2.54: FEED -3.302,0; NC 3.302,0
TE_FSM8JSMA_HS = smd 1.4 x 2.1: 1 -2.25,4.55; 2 -2.25,-4.55; 3 2.25,4.55; 4 2.25,-4.55
QFN-64 = smd 1.562 x 0.28: 1 -4.881,3.75; 2 -4.881,3.25; 3 -4.881,2.75; 4 -4.881,2.25; 5 -4.881,1.75; 6 -4.881,1.25; 7 -4.881,0.75; 8 -4.881,0.25; 9 -4.881,-0.25; 10 -4.881,-0.75; 11 -4.881,-1.25; 12 -4.881,-1.75; 13 -4.881,-2.25; 14 -4.881,-2.75; 15 -4.881,-3.25; 16 -4.881,-3.75; 33 4.881,-3.75; 34 4.881,-3.25; 35 4.881,-2.75; 36 4.881,-2.25; 37 4.881,-1.75; 38 4.881,-1.25; 39 4.881,-0.75; 40 4.881,-0.25; 41 4.881,0.25; 42 4.881,0.75; 43 4.881,1.25; 44 4.881,1.75; 45 4.881,2.25; 46 4.881,2.75; 47 4.881,3.25; 48 4.881,3.75 | smd 0.28 x 1.562: 17 -3.75,-4.881; 18 -3.25,-4.881; 19 -2.75,-4.881; 20 -2.25,-4.881; 21 -1.75,-4.881; 22 -1.25,-4.881; 23 -0.75,-4.881; 24 -0.25,-4.881; 25 0.25,-4.881; 26 0.75,-4.881; 27 1.25,-4.881; 28 1.75,-4.881; 29 2.25,-4.881; 30 2.75,-4.881; 31 3.25,-4.881; 32 3.75,-4.881; 49 3.75,4.881; 50 3.25,4.881; 51 2.75,4.881; 52 2.25,4.881; 53 1.75,4.881; 54 1.25,4.881; 55 0.75,4.881; 56 0.25,4.881; 57 -0.25,4.881; 58 -0.75,4.881; 59 -1.25,4.881; 60 -1.75,4.881; 61 -2.25,4.881; 62 -2.75,4.881; 63 -3.25,4.881; 64 -3.75,4.881
SOT23-DBV = smd 0.55 x 1.2: 1 -0.95,-1.3; 2 0,-1.3; 3 0.95,-1.3; 4 0.95,1.3; 5 -0.95,1.3
CRYSTAL-SMD-5X3 = smd 1.9 x 1.1: 1 -1.85,-1.15; 2 1.85,-1.15; 3 1.85,1.15; 4 -1.85,1.15

### Placement (x,y rotation side)
B1  66.2,86.92 270 top
BATT1  66.2,65.2 270 bottom
BRIDGE  49.1,66.2 0 top
C1  78.7,79.7 90 top
C2  78.7,76.2 270 top
C3  74.75,82.35 0 top
C4  57.9,79.55 180 top
C5  109.5,111.65 225 top
C6  107.28,107.39 315 top
C7  111.05,22.15 135 top
C8  106.7,24.19 225 top
C9  24.75,18.95 45 top
C10  25.42,24.64 135 top
C11  21.75,111.4 315 top
C12  24.94,107.89 45 top
C13  48.7,58.3 0 top
C14  51.5,58.45 270 top
C15  57.85,81.8 180 top
C18  67.95,70.05 0 top
C19  64.35,70.05 180 top
C20  61.3,65.95 180 top
C21  62.8,86.9 180 top
C22  62.75,89 180 top
C23  61.3,68 180 top
C24  57.9,75.4 180 top
C25  74.75,73.35 0 top
C26  61.3,63.9 180 top
D1  112.77,114.8 225 top
D2  114.28,18.9 135 top
D3  19.49,17.4 225 top
D4  17.15,113.05 315 top
D5  58.8,59.4 0 top
D6  65.3,59.75 0 top
D7  74.35,66.3 270 top
D8  72.15,66.3 270 top
H1  54.35,37.15 0 top
I1  66.2,66.2 0 top
J1  45.95,68.75 270 top
J2  72.15,56.9 270 top
JP2  86.65,59.7 90 top
M1  116.86,117.48 315 top
M2  116.86,14.92 225 top
M3  15.54,14.92 135 top
M4  14.69,116.93 45 top
Q1  114.73,112.39 315 top
Q2  111.95,16.99 225 top
Q3  17.62,19.79 135 top
Q4  19.54,114.94 45 top
R1  57.9,77.45 0 top
R2  107.95,113.2 225 top
R3  111.1,110.1 225 top
R4  112.5,23.6 135 top
R5  109.6,20.65 135 top
R6  23.15,20.5 45 top
R7  21.4,22.2 45 top
R8  20.2,109.85 315 top
R9  23.3,112.9 315 top
R10  73.55,50.7 0 top
R11  73.55,48.6 0 top
R12  73.45,69.25 90 top
R13  71.25,69.3 90 top
R14  58.85,55.7 0 top
R15  65.35,55.7 0 top
RFANT  66.29,92.67 90 top
SW1  62.15,50.9 270 top
U1  66.2,77.8 270 top
U$3  [UCSD_LOGO]  74.25,45.8 0 top
V_REG  48.37,61.92 180 top
Y1  75.3,77.9 270 top

### Tracks (layer width: path | path; a pad name or v marks a point on that pad's centre or on a via)
3V  (via drill 0.2)
  Top 0.152: 62.7,66.45 64.2,66.45 I1.P3 | C20.1 62.7,66.45 | 62.7,67.95 62.2,67.95 C23.1 62.7,67.95 | 62.7,67.95 64.45,67.95 | 64.45,67.95 64.7,67.95 I1.P1 | 62.7,67.95 62.7,66.45 | 62.7,66.45 C20.1 | 65.2,64.45 64.7,64.45 | 65.2,64.45 65.45,64.45 | 65.2,64.45 I1.P7 | 64.7,64.45 64.2,64.45 64.2,65.45 I1.P5 | 64.7,64.45 I1.P6 | 67.7,63.45 67.7,64.45 I1.P13 | 65.7,63.45 67.7,63.45 | 65.7,63.45 65.45,63.7 65.45,63.95 | 65.45,64.45 65.45,63.95 | 65.45,64.45 I1.P8 65.45,63.95 | 65.45,63.95 62.2,63.95 | 62.2,63.95 C20.1 | 62.2,63.95 C26.1 | C25.1 73.7,73.45 72.2,74.95 72.2,76.45 71.2,76.45 U1.54 70.95,76.45 69.45,76.45 | 69.45,76.45 69.45,78.45 69.95,78.95 70.95,78.95 U1.59 | 58.95,77.45 59.95,78.45 61.2,78.45 U1.23 | 58.95,77.45 58.95,75.45 C24.1 58.95,75.2 59.45,74.7 v59.7,74.7 | 58.95,77.45 R1.2 | 66.2,71.2 66.2,69.45 65.95,69.2 65.95,67.95 I1.P22 I1.P23 | 66.2,71.2 67.7,71.2 67.95,71.45 U1.44 67.95,73.7 66.95,74.7 | 62.95,74.2 62.95,74.7 66.95,74.7 | 62.95,74.2 U1.34 | 62.95,74.2 v62.7,74.2 | 69.45,76.45 67.7,74.7 66.95,74.7 | 64.45,67.95 64.45,71.2 66.2,71.2 | R11.2 74.7,48.7 74.7,50.7 R10.2 74.45,50.7 73.15,52 | 73.15,52 72.2,52.95 70.45,52.95 68.55,54.85 | 68.55,54.85 67.7,55.7 67.7,57.95 64.95,57.95 | 64.95,57.95 63.45,59.45 D6.A 63.45,59.7 63.45,61.2 65.7,63.45 | D5.A 56.2,59.95 51.5,59.95 | 51.5,59.95 51.3,59.95 50.63,60.62 V_REG.5 | v55.45,59.2 56.7,59.2 D5.A | 64.95,57.95 58.2,57.95 D5.A | C14.1 51.5,59.95 | v76.2,52 73.15,52 | v68.55,53.9 68.55,54.85 | v69.3,62.8 68.35,62.8 67.7,63.45
  Bottom 0.152: 59.7,74.2 62.77,74.2 v62.7,74.2 | 59.7,74.2 59.7,74.38 v59.7,74.7 | 59.7,74.2 | v55.45,59.2 55.45,38.2 54.45,37.2 H1.1
  pour Route15: 57.1,83.8 57.1,89.75 53.7,89.75 53.7,43.7 80.7,43.7 80.7,89.75 71.25,89.75 71.3,83.8
BAT_GND  (via drill 0.2)
  Top 0.762: Q3.S 17.95,21.45 v20.7,24.2 23.2,26.7 C10.2 | Q2.S 110.2,17.2 v108.45,18.95 106.7,20.7 105.95,20.7 104.7,21.95 C8.2 | Q4.S 21.2,114.95 v22.45,114.95 23.2,114.95 26.95,111.2 26.95,110.2 C12.2 | v50.95,55.95 49.95,55.95 49.95,57.94 C13.2 | 110.45,106.7 109.7,105.95 109.7,105.2 C6.2 | 110.45,106.7 114.45,110.7 Q1.S | v110.7,106.45 110.45,106.7 | BRIDGE.P2 50.4,65.2 BATT1.-
  pour Route2: 52.2,42.2 82.2,42.2 82.2,155.4 154.3,155.4 154.3,-42.3 -43.7,-42.3 -43.7,158 52.2,158
GND  (via drill 0.2, 0.35)
  Top 0.152: 63.45,71.7 U1.35 | 63.45,71.7 62.7,71.7 62.45,71.95 U1.33 62.45,72.95 59.45,72.95 v58.2,74.2 57.2,75.2 C24.2 57.2,75.45 57.7,75.95 57.7,79.45 57.2,79.45 C4.2 57.2,79.7 58.2,80.7 59.7,80.7 60.45,79.95 61.2,79.95 U1.20 61.45,79.95 62.45,79.95 | V_REG.2 48.45,63.45 48.45,64.2 48.8,64.2 | 60.45,65.95 60.45,64.2 | 60.45,64.2 60.45,63.95 C26.2 60.45,64.2 | 60.45,65.95 60.45,67.95 C23.2 60.45,68.2 61.2,68.95 62.45,68.95 63.45,69.95 C19.2 63.45,70.2 63.45,71.7 | 60.45,65.95 C20.2 | 60.45,64.2 48.8,64.2 | 71.95,79.95 71.2,79.95 U1.61 70.95,79.95 62.45,79.95 | 71.95,79.95 72.2,79.7 72.2,78.45 71.2,78.45 U1.58 70.95,78.45 69.95,78.45 69.95,77.2 70.2,76.95 70.95,76.95 U1.55 71.2,76.95 72.2,76.95 73.2,75.95 73.2,74.7 76.95,74.7 | 62.45,79.95 62.45,78.2 62.2,77.95 61.45,77.95 U1.24 | 71.95,79.95 72.95,80.95 74.2,80.95 75.45,82.2 C3.2 75.7,82.2 77.2,82.2 78.7,80.7 C1.2 | D7.C 73.45,64.45 71.45,64.45 D8.C 71.2,64.7 70.45,65.45 68.2,65.45 | 68.2,65.95 68.2,65.45 | 68.2,66.95 68.2,66.45 | 68.2,66.45 68.2,65.95 | 68.2,65.95 I1.P15 | 68.2,66.45 I1.P16 | 68.2,65.45 I1.P14 | 67.2,67.95 66.95,67.95 I1.P20 | 67.2,67.95 67.7,67.95 | 67.2,67.95 I1.P19 | 67.7,67.95 67.7,68.95 68.7,69.95 C18.2 68.7,70.2 68.45,70.2 68.45,71.2 | 68.45,71.2 U1.45 | 68.2,66.95 68.2,67.95 67.7,67.95 | 68.2,66.95 I1.P17 | 67.7,67.95 I1.P18 | 76.95,74.7 77.45,75.2 78.7,75.2 C2.2 | 76.95,74.7 75.7,73.45 C25.2 75.7,73.2 76.45,72.45 | 68.45,71.2 75.2,71.2 76.45,72.45 | 65.2,54.7 v65.45,54.45 66.7,53.2 SW1.1 | 65.2,54.7 64.2,55.7 R15.IN | 57.7,54.7 57.7,55.7 R14.IN 52.9,55.7 51.5,57.1 C14.2 | 57.7,54.7 57.7,53.2 SW1.2 | 57.7,54.7 65.2,54.7
  Top 0.152: C9.2 25.2,19.7 25.2,20.95 23.95,22.2 22.7,22.2 22.2,22.7 R7.2 22.2,22.95 39.65,40.4 56.18,40.4 H1.3 | C5.2 108.7,110.95 110.2,109.45 R3.2 87.65,86.65 v77.6,86.65 | R9.2 23.95,112.2 22.7,110.95 22.45,110.95 C11.2 45.95,87.2 v54.35,87.2 | 109.2,21.7 110.2,22.7 C7.2 | 109.2,21.7 108.95,21.45 R5.2 109.2,21.7 | 65.45,82.7 64.95,82.7 U1.11 | U1.7 66.95,84.5 67.45,85 v67.45,85.2 | 65.45,82.7 U1.10 | v106.45,21.7 109.2,21.7 | v64.95,85.2 65.45,84.75 65.45,82.7 | BRIDGE.P1 48.8,64.2 | 76.45,72.45 76.45,71.35 77.5,70.3 79.85,70.3 81.95,72.4 JP2.GND
  Route2 0.152: 71.3,87.84 70.6,87.84
  Bottom 0.152: 70.85,35.64 60.94,35.64 59.49,37.09 H1.3 | J2.6 73.44,54.31 74.51,53.25 74.51,45.17 70.85,41.51 70.85,35.64 | 106.45,21.95 v106.45,21.7 | 106.45,21.95 106.47,21.97 | 106.45,21.95 87.25,41.15 82.95,41.15 80.15,38.35 80.15,36.45 79.35,35.65 70.85,35.65 70.85,35.64
  other vias: 59.05,89.5 59.05,88.25 59.05,86.95 59.05,85.45 60.4,85.2 61.75,85.2 62.95,85.2 64,85.2 68.7,85.25 69.8,85.2 69.85,86.2 69.85,87.3 69.85,88.5 69.85,89.55
  pour Top: 58.2,89.7 58.2,84.5 70.6,84.5 70.6,89.7
  pour Route2: 57.1,89.75 53.7,89.75 53.7,43.7 80.7,43.7 80.7,89.75 71.3,89.75 71.3,83.8 57.1,83.8
  pour Route2: 58.2,89.7 70.6,89.7 70.6,84.5 58.2,84.5
MISO  (via drill 0.2)
  Top 0.152: U1.39 65.45,74.2 v65.7,74.2
  Route15 0.152: v65.7,74.2 65.7,69.95 74.45,61.2 74.45,56.45 73.7,55.7 73.2,55.7 71.95,56.95 71.95,58.2 70.88,59.27 J2.1
MOSI  (via drill 0.2)
  Top 0.152: U1.38 64.95,74.15 v64.9,74.2
  Route15 0.152: v64.9,74.2 64.9,69.24 64.25,68.6 64.25,64.08 66.23,62.1 70.6,62.1 72.2,60.5 72.2,58.45 73.42,57.23 J2.4
N$1  (via drill 0.2)
  Top 0.152: v65.2,56.7 65.45,56.7 66.45,55.7 R15.OUT | v65.2,59.45 66.7,59.45 D6.C
  Bottom 0.152: v65.2,59.45 v65.2,56.7
N$2
  Top 0.25: B1.4 67,85.7 66.45,85.15 U1.8
N$3
  Top 0.25: B1.3 65.4,85.65 65.95,85.1 U1.9
N$4
  Top 0.152: C4.1 58.95,79.45 61.2,79.45 U1.21 61.45,79.45 61.45,78.95 U1.22
N$5
  Top 0.152: 78.7,77.2 C2.1 78.24,77.55 76.45,77.55 | U1.56 76.45,77.55 | Y1.3 76.45,77.55
N$6  (via drill 0.2)
  Top 0.152: v72.2,81.95 73.45,81.95 73.7,82.2 C3.1 | v69.7,79.45 70.95,79.45 U1.60
  Route2 0.152: v69.7,79.45 v72.2,81.95
N$7
  Top 0.152: U1.57 74.2,78.05 | 74.2,78.05 77.94,78.05 C1.1 | Y1.1 74.15,78.1 74.2,78.05
N$8
  Top 0.762: D1.A 111.7,113.7 115.2,113.7 115.45,113.45 Q1.D 115.45,113.95 116.2,113.95 118.2,115.95 M1.V-
N$9  (via drill 0.2)
  Top 0.152: v58.7,56.7 58.95,56.7 59.95,55.7 R14.OUT | v58.7,59.2 60.2,59.2 D5.C
  Bottom 0.152: v58.7,59.2 v58.7,56.7
N$10
  Top 0.152: R4.1 112.95,22.7 111.95,21.7 111.7,21.7 C7.1 111.45,21.45 110.2,20.2 R5.1 110.45,19.95 111.7,18.7 Q2.G
N$11
  Top 0.762: D2.A 113.2,19.95 113.2,16.2 112.95,16.2 Q2.D 112.95,15.95 115.2,13.7 M2.V-
N$12
  Top 0.152: R7.1 20.7,21.45 19.45,20.2 19.2,20.2 Q3.G 19.2,19.95 22.45,19.95 R6.1 22.7,19.7 23.95,18.45 C9.1
N$13
  Top 0.152: Q1.G R3.1 | R2.1 108.7,113.7 109.95,112.45 C5.1 110.2,112.2 Q1.G | Q1.G
N$14
  Top 0.762: D3.A 18.45,16.2 18.45,12.2 15.95,12.2 14.2,13.95 14.2,16.2 M3.V- 14.2,16.7 14.7,16.7 16.7,18.7 Q3.D
N$15
  Top 0.152: R8.1 19.7,110.7 20.95,111.95 C11.1 19.95,113.2 Q4.G 19.95,113.45 22.45,113.45 R9.1
N$16
  cutout Route2: 58.15,98.15 70.5,98.15 70.5,90.2 58.15,90.2
N$17
  Top 0.152: R12.1 D7.A
N$18
  Top 0.762: J1.1 51.6,68.75 BATT1.+
N$19
  Top 0.152: B1.2 65.2,86.95 63.7,86.95 C21.1
N$20
  Top 0.762: D4.A 18.2,111.95 18.2,115.7 18.45,115.7 Q4.D 18.7,116.2 18.2,116.2 16.2,118.2 M4.V-
N$21
  Top 0.152: I1.P21 66.45,67.95 66.45,69.2 67.2,69.95 C18.1
N$22
  cutout Route15: 58.15,98.15 70.5,98.15 70.5,90.2 58.15,90.2
N$23
  Top 0.152: I1.P24 65.2,67.95 65.2,69.95 C19.1
N$24
  Top 0.1: 65.45,87.7 B1.1
  Top 0.762: 65.45,87.7 65.7,87.95 65.7,89.45 66.2,89.45 RFANT.FEED 65.45,89.45 64.95,89.45 64.7,89.2 63.7,89.2 C22.1
N$25  (via drill 0.2)
  Top 0.152: v59.7,81.7 58.95,81.7 C15.1
  Bottom 0.152: JP2.DTR 86.62,59.72 85.48,60.87 85.48,75.27 80.07,80.68 59.7,80.68 v59.7,81.7
N$26
  Top 0.152: D8.A 71.45,66.7 71.45,68.2 R13.1
PB6  (via drill 0.2)
  Top 0.152: v69.95,69.45 72.7,69.45 R12.2 | v66.7,71.7 66.95,71.95 U1.42
  Route2 0.152: v69.95,69.45 68.2,71.2 67.2,71.2 v66.7,71.7
PB7  (via drill 0.2)
  Top 0.152: v69.95,70.2 71.2,70.2 R13.2 | U1.43 v67.45,71.7
  Route2 0.152: v69.95,70.2 68.45,71.7 v67.45,71.7
PWM1  (via drill 0.2)
  Top 0.152: v79.95,79.95 81.45,79.95 108.7,107.2 109.7,107.2 111.2,108.7 111.45,108.7 111.45,109.7 108.95,112.2 107.7,112.2 107.45,112.45 R2.2 | v69.7,74.7 69.7,74.45 70.2,73.95 70.95,73.95 U1.49
  Bottom 0.152: 70.92,78.39 69.97,77.43 69.97,74.97 v69.7,74.7 | 70.92,78.39 72.14,79.61 79.38,79.61 79.72,79.95 v79.95,79.95 | 62.01,37.17 H1.4 61.26,37.15 56.73,41.69 56.73,58.99 54.34,61.37 54.34,68.49 53.02,69.81 53.02,76.28 55.18,78.44 70.87,78.44 70.92,78.39
PWM2  (via drill 0.2)
  Top 0.152: v75.2,72.2 73.45,72.2 73.2,72.45 72.95,72.45 72.95,73.45 71.95,74.45 71.2,74.45 U1.50 | R4.2 111.7,24.45 106.55,24.45 89.35,41.65 81.7,41.65 79.7,39.65 79.7,36.7 v79.2,36.2 79.2,35.95 65.7,35.95 64.7,36.95 H1.5
  Bottom 0.152: v75.2,72.2 75.2,39.42 75.83,38.79 78.11,38.79 79.2,37.7 v79.2,36.2
PWM3  (via drill 0.2)
  Top 0.152: R6.2 23.7,21.2 23.2,21.7 22.2,21.7 20.95,22.95 20.95,23.45 21.2,23.45 22.7,24.95 23.7,24.95 40.3,41.55 63.9,41.55 67.05,38.4 H1.6 | v68.95,75.2 69.95,75.2 70.2,74.95 70.95,74.95 U1.51
  Route15 0.152: v68.95,75.2 65.2,75.2 62.45,72.45 62.45,42.45 67.05,37.85 H1.6
PWM4  (via drill 0.2)
  Top 0.152: v55.45,76.2 23.95,107.7 22.2,107.7 20.95,108.95 R8.2 | v66.45,74.2 U1.41
  Bottom 0.152: 55.46,76.26 55.46,76.49 56.52,77.55 63.1,77.55 v66.45,74.2 | 55.46,76.26 55.68,76.03 55.68,61.86 57.97,59.57 57.97,48.75 69.57,37.15 H1.7 | v55.45,76.2 55.46,76.26
RESET  (via drill 0.2)
  Top 0.152: 56.7,77.45 56.2,77.95 56.2,81.7 56.95,81.7 C15.2 57.2,81.95 58.2,82.95 v61.2,82.95 | U1.12 64.45,81.45 v62.7,81.45 | 66.7,48.7 57.7,48.7 SW1.4 | v70.7,48.7 66.7,48.7 | 66.7,48.7 SW1.3 | 56.7,77.45 56.2,76.95 v56.2,76.45 | 56.7,77.45 R1.1
  Route2 0.152: v61.2,82.95 v62.7,81.45
  Bottom 0.152: 56.22,76.56 56.22,76.45 v56.2,76.45 56.7,75.95 56.7,64.55 61.07,60.18 67.04,60.18 69.55,57.67 69.55,55.61 70.85,54.31 J2.5 70.7,54.2 v70.7,48.7
RX0  (via drill 0.2)
  Top 0.152: v69.2,74.2 69.2,73.95 68.95,73.7 U1.46
  Route15 0.152: JP2.TXO 86.45,64.95 85.95,64.95 85.2,65.7 84.35,65.7 80.3,69.75 77.55,69.75 76.65,70.65 76.65,73.85 76.3,74.2 v69.2,74.2
SCK  (via drill 0.2)
  Top 0.152: U1.37 64.45,71.7 v63.95,71.7
  Route15 0.152: J2.3 63.95,63.83 v63.95,71.7
SCL  (via drill 0.2)
  Top 0.152: v63.2,67.2 63.95,67.2 64.2,66.95 I1.P2 | v60.2,73.45 60.2,77.45 61.2,77.45 U1.25 | R11.1 72.45,48.45 72.45,37.45 72.43,37.45 H1.8
  Route15 0.152: v63.2,67.2 63.2,64.95 62.95,64.7 62.95,46.95 71.95,37.95 71.95,37.2 72,37.15 H1.8
  Bottom 0.152: v60.2,73.45 60.18,73.45 60.18,70.7 63.15,67.72 63.15,67.25 v63.2,67.2
SDA  (via drill 0.2)
  Top 0.152: v63.45,64.45 63.2,64.45 63.2,65.7 63.45,65.95 64.2,65.95 I1.P4 | v62.7,76.95 61.45,76.95 U1.26 | R10.1 72.7,50.7 73.7,49.7 73.7,38.08 74.63,37.15 H1.9
  Route15 0.152: H1.9 74.5,37.15 74.45,37.2 74.45,37.95 69.7,42.7 69.7,57.05 63.45,63.3 v63.45,64.45
  Bottom 0.152: 63.15,64.37 62.96,64.18 | v63.45,64.45 63.2,64.45 62.95,64.2 62.96,64.18 | 62.96,64.18 59.2,64.18 57.51,65.87 57.51,76.11 58.36,76.95 v62.7,76.95
TX0  (via drill 0.2)
  Top 0.152: U1.47 69.45,71.7 v74.45,71.7 | v74.45,62.45 86.45,62.45 JP2.RXI
  Bottom 0.152: v74.45,62.45 v74.45,71.7
VBAT  (via drill 0.2)
  Top 0.762: M1.V+ 115.95,117.95 115.7,117.95 v114.95,117.2 113.95,116.2 D1.C 113.7,115.7 105.95,115.7 105.95,110.45 105.2,109.7 C6.1 | 19.45,17.45 19.7,17.7 | 19.7,17.7 20.45,18.45 D3.C | 19.45,17.45 18.2,17.45 16.45,15.7 16.45,14.45 M3.V+ | C10.1 27.45,22.2 26.7,21.45 26.7,16.95 19.95,16.95 19.45,17.45 | 116.57,16.82 117.7,15.7 M2.V+ | 116.57,16.82 115.7,17.7 D2.C | 15.2,115.2 14.2,116.2 M4.V+ | 15.2,115.2 15.95,114.45 D4.C | J1.2 47.45,66.2 47.45,63.45 V_REG.3 47.45,62.95 47.45,62.45 47.7,62.2 | 47.7,62.2 47.95,61.95 49.2,61.95 49.2,63.2 V_REG.1 | 47.7,62.2 47.45,61.95 46.45,61.95 46.45,58.3 C13.1 | v106.7,26.45 108.7,26.45 C8.1 | v24.95,105.7 22.95,105.7 C12.1 | v15.45,115.45 15.2,115.2 | v116.45,16.7 116.57,16.82 | v19.45,17.95 19.7,17.7
  pour Route15: 52.2,157.6 52.2,42.2 82.2,42.2 82.2,155.4 154.3,155.4 154.3,-26.2 -25.1,-26.2 -25.1,157.6

### Text on the board
tSilk: + | + | CTS | VCC | TX0 | RX1 | 3V | BAT_GND | GND | PWM1 | PWM2 | PWM3 | PWM1 | PWM4 | SDA | VBAT | + | +